# Altium schematic sheet NanoPiAir_SDR_Shield_V1.SchDoc
size A3; SheetNumber: 5; SheetTotal: 6; SPICEModelCacheYCATXEQH: <root> / <DocumentId>YCATXEQH</DocumentId> / </root>
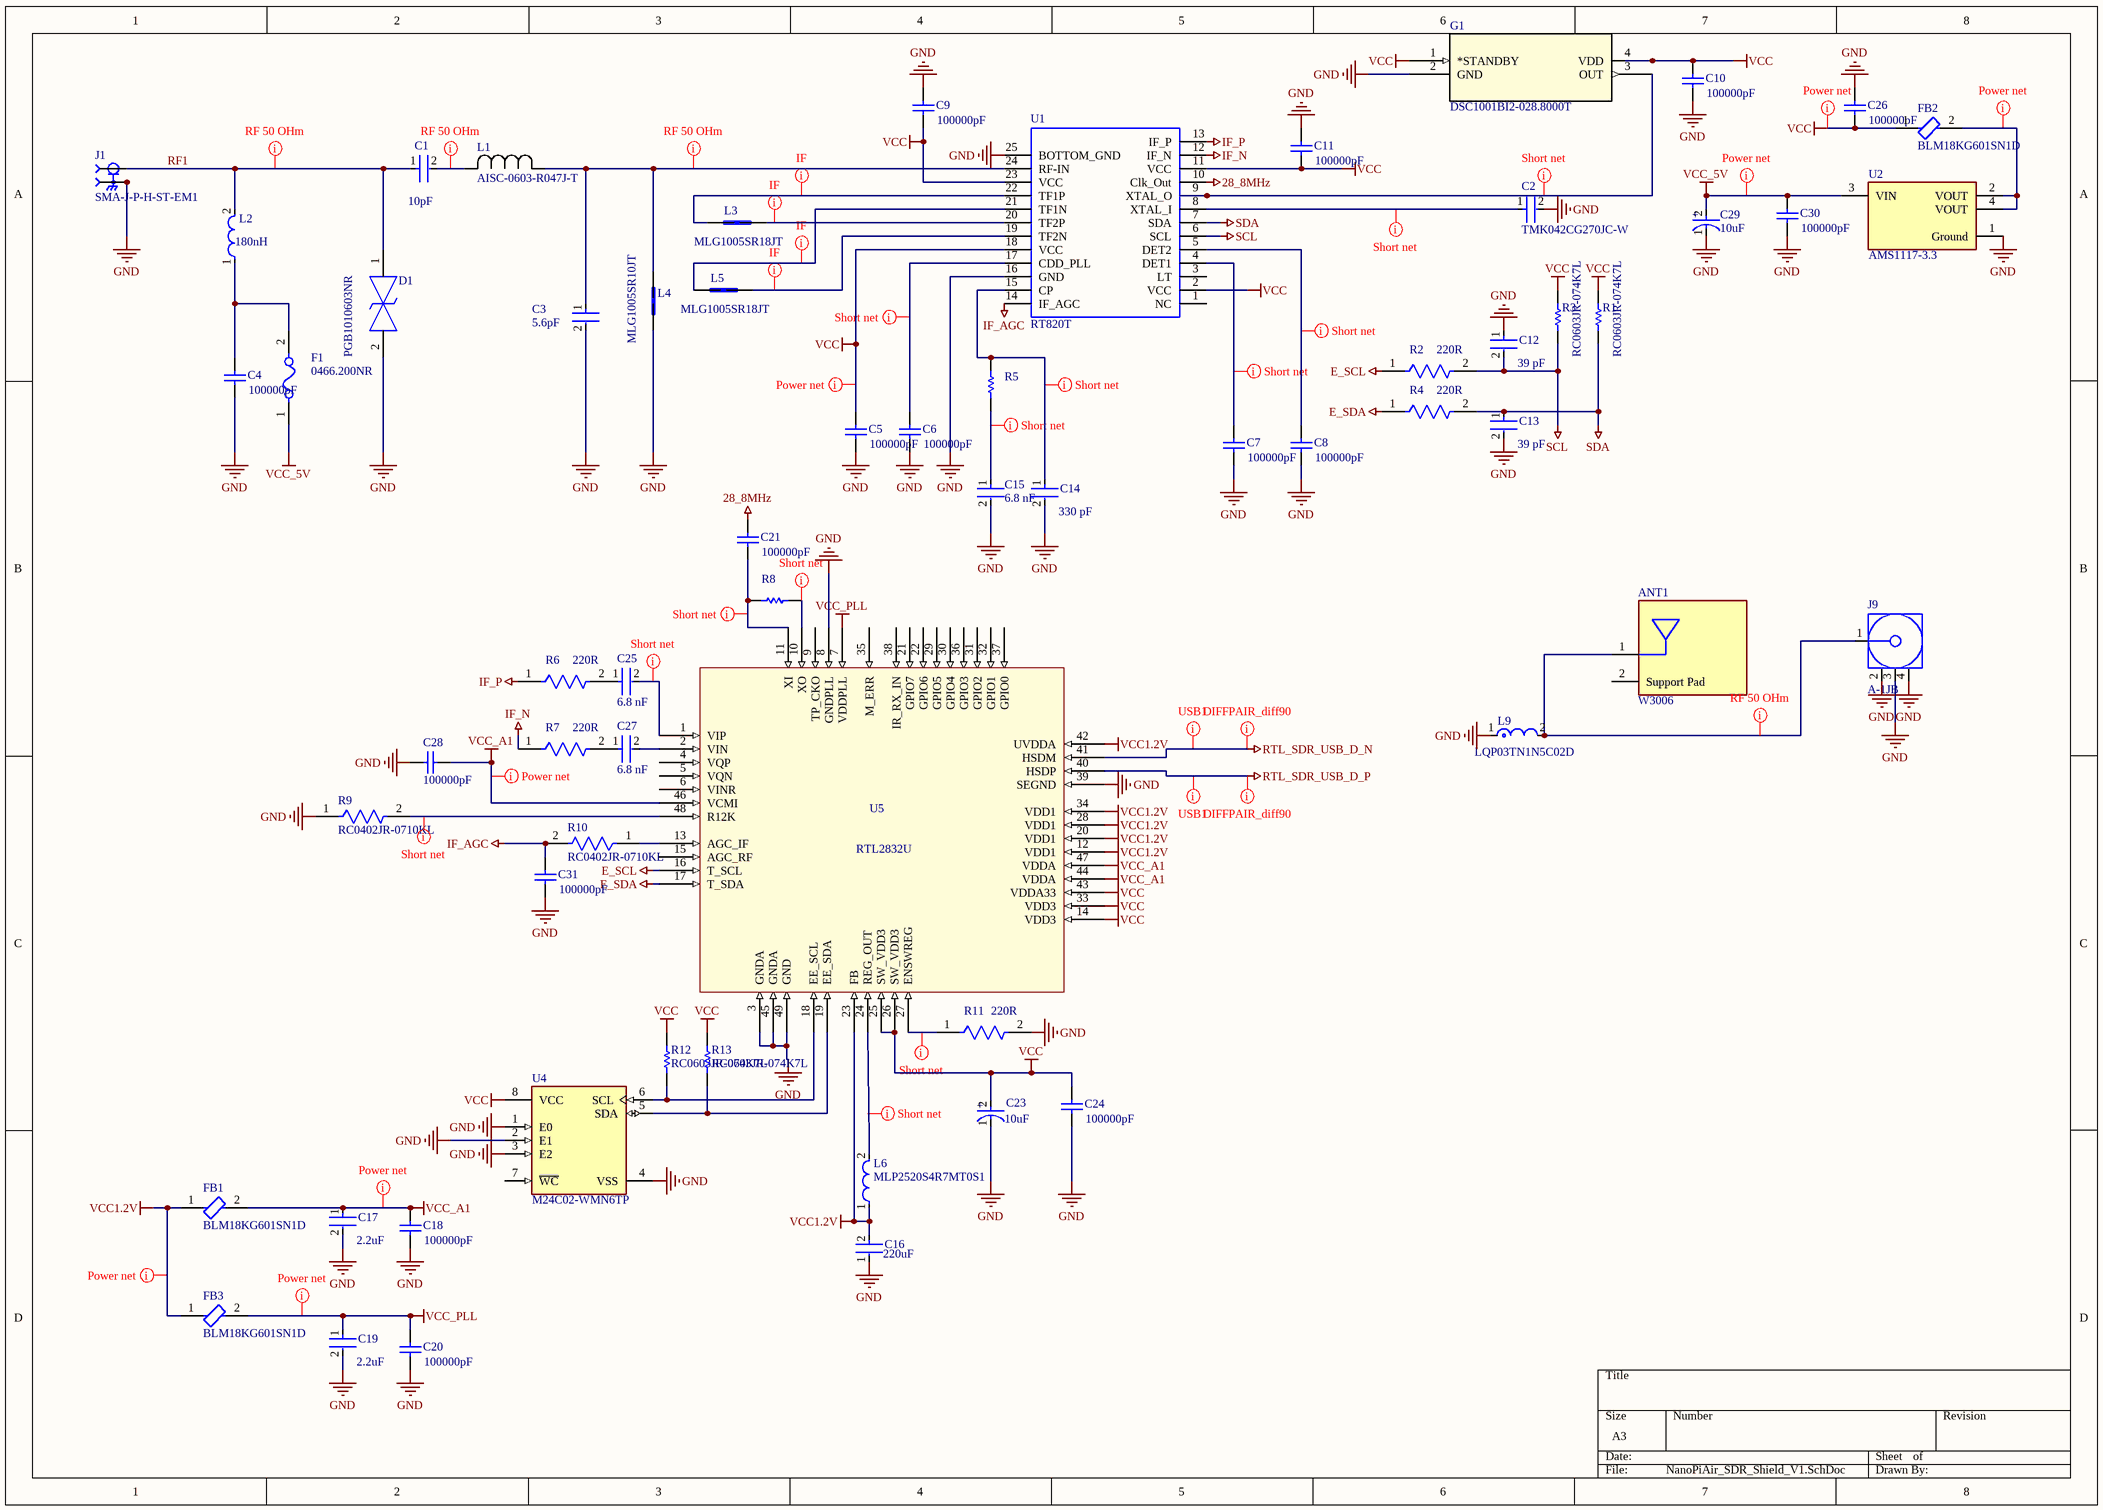
[diagram p0: NanoPiAir_SDR_Shield_V1.SchDoc]

## Parts
ANT1  W3006  [FP-W3006-0]
C1  Capacitance: 10pF  [FP-GJM155-0_05-IPC_B]  (hidden comment: GJM1555C1H100GB01D)
C2  TMK042CG270JC-W  [FP-01005-L_0_4_0_02-W_0_2-MFG]
C3  Capacitance: 5.6pF  [FP-GJM155-0_05-IPC_B]  (hidden comment: GJM1555C1H5R6CB01D)
C4  Capacitance: 100000pF  [CAPC1050X55X23ML05T13]  (hidden comment: CL05B104KO5NNNC)
C5  Capacitance: 100000pF  [CAPC1050X55X23ML05T13]  (hidden comment: CL05B104KO5NNNC)
C6  Capacitance: 100000pF  [CAPC1050X55X23ML05T13]  (hidden comment: CL05B104KO5NNNC)
C7  Capacitance: 100000pF  [CAPC1050X55X23ML05T13]  (hidden comment: CL05B104KO5NNNC)
C8  Capacitance: 100000pF  [CAPC1050X55X23ML05T13]  (hidden comment: CL05B104KO5NNNC)
C9  Capacitance: 100000pF  [CAPC1050X55X23ML05T13]  (hidden comment: CL05B104KO5NNNC)
C10  Capacitance: 100000pF  [CAPC1050X55X23ML05T13]  (hidden comment: CL05B104KO5NNNC)
C11  Capacitance: 100000pF  [CAPC1050X55X23ML05T13]  (hidden comment: CL05B104KO5NNNC)
C12  Capacitance: 39 pF  [FP-AC0402-0_5-MFG]  (hidden comment: AC0402JRNPO9BN390)
C13  Capacitance: 39 pF  [FP-AC0402-0_5-MFG]  (hidden comment: AC0402JRNPO9BN390)
C14  Capacitance: 330 pF  [FP-CC0402-MFG]  (hidden comment: CC0402KRX7R7BB331)
C15  value 6.8 nF  [FP-CC0402-MFG]  (hidden comment: CC0402KRX7R9BB682)
C16  Capacitance: 220uF  [FP-GRM31C-0_3-e0_3_0_9-IPC_C]  (hidden comment: GRM31CR60J227ME11L)
C17  Capacitance: 2.2uF  [FP-GRM155-0_05-MFG]  (hidden comment: GRM155R61A225KE95D)
C18  Capacitance: 100000pF  [CAPC1050X55X23ML05T13]  (hidden comment: CL05B104KO5NNNC)
C19  Capacitance: 2.2uF  [FP-GRM155-0_05-MFG]  (hidden comment: GRM155R61A225KE95D)
C20  Capacitance: 100000pF  [CAPC1050X55X23ML05T13]  (hidden comment: CL05B104KO5NNNC)
C21  Capacitance: 100000pF  [CAPC1050X55X23ML05T13]  (hidden comment: CL05B104KO5NNNC)
C23  Capacitance: 10uF  [FP-TAJA-MFG]  (hidden comment: TAJA106K010RNJ)
C24  Capacitance: 100000pF  [CAPC1050X55X23ML05T13]  (hidden comment: CL05B104KO5NNNC)
C25  value 6.8 nF  [FP-CC0402-MFG]  (hidden comment: CC0402KRX7R9BB682)
C26  Capacitance: 100000pF  [CAPC1050X55X23ML05T13]  (hidden comment: CL05B104KO5NNNC)
C27  value 6.8 nF  [FP-CC0402-MFG]  (hidden comment: CC0402KRX7R9BB682)
C28  Capacitance: 100000pF  [CAPC1050X55X23ML05T13]  (hidden comment: CL05B104KO5NNNC)
C29  Capacitance: 10uF  [FP-TAJA-MFG]  (hidden comment: TAJA106K010RNJ)
C30  Capacitance: 100000pF  [CAPC1050X55X23ML05T13]  (hidden comment: CL05B104KO5NNNC)
C31  Capacitance: 100000pF  [CAPC1050X55X23ML05T13]  (hidden comment: CL05B104KO5NNNC)
D1  PGB1010603NR  [PGB1010603MR]
F1  0466.200NR  [FP-0466-MFG]
FB1  BLM18KG601SN1D  [FP-BLM18-0_15-t0_8-IPC_A]
FB2  BLM18KG601SN1D  [FP-BLM18-0_15-t0_8-IPC_A]
FB3  BLM18KG601SN1D  [FP-BLM18-0_15-t0_8-IPC_A]
G1  DSC1001BI2-028.8000T  [CDFN4_5X3P2_MCH]
J1  SMA-J-P-H-ST-EM1  [SAMTEC_SMA-J-P-H-ST-EM1]
J9  A-1JB  [AMPH-A-1JB_V]
L1  AISC-0603-R047J-T  [AISC-0603_ABR]
L2  Inductance: 180nH  [FP-LQM18NN_00-IPC_C]  (hidden comment: LQM18NNR18K00D)
L3  MLG1005SR18JT  [CAPC1005X55N]
L4  MLG1005SR10JT  [CAPC1005X55N]
L5  MLG1005SR18JT  [CAPC1005X55N]
L6  MLP2520S4R7MT0S1  [FP-MLP2520M-IPC_C]
L9  LQP03TN1N5C02D  [FP-LQP03TG_02-IPC_A]
R1  RC0603JR-074K7L  [RESC1608X55X25ML10T15]
R2  Resistance: 220R  [FP-AC0402-IPC_C]  (hidden comment: AC0402FR-07220RL)
R3  RC0603JR-074K7L  [RESC1608X55X25ML10T15]
R4  Resistance: 220R  [FP-AC0402-IPC_C]  (hidden comment: AC0402FR-07220RL)
R5  RK73H1ETTP1801F  [RESC1005X40X25ML10T10]  (value not drawn)
R6  Resistance: 220R  [FP-AC0402-IPC_C]  (hidden comment: AC0402FR-07220RL)
R7  Resistance: 220R  [FP-AC0402-IPC_C]  (hidden comment: AC0402FR-07220RL)
R8  RC0402JR-07150KL  [RESC1005X40X25ML05T10]  (value not drawn)
R9  RC0402JR-0710KL  [FP-RC0402-0_4-IPC_C]
R10  RC0402JR-0710KL  [FP-RC0402-0_4-IPC_C]
R11  Resistance: 220R  [FP-AC0402-IPC_C]  (hidden comment: AC0402FR-07220RL)
R12  RC0603JR-074K7L  [RESC1608X55X25ML10T15]
R13  RC0603JR-074K7L  [RESC1608X55X25ML10T15]
U1  RT820T  [QFN24_4X4_SIL-L]
U2  AMS1117-3.3  [FP-AMS1117-IPC_C]
U4  M24C02-WMN6TP  [FP-SO8N-SO-A-MFG]
U5  RTL2832U  [QFN40P600X600X84_HS-49N]

## Nets
28_8MHz: C21.2 U1.10(Clk_Out)
E_SCL: R2.1 U5.16(T_SCL)
E_SDA: R4.1 U5.17(T_SDA)
GND: C2.2 C3.2 C4.1 C5.1 C6.1 C7.1 C8.1 C9.2 C10.1 C11.2 C12.1 C13.2 C14.2 C15.2 C16.1 C17.2 C18.1 C19.2 C20.1 C23.1(C) C24.1 C26.2 C28.2 C29.1(C) C30.1 C31.1 D1.2 G1.2(GND) J1.2_1 J1.2_2 J1.3_1 J1.3_2 J9.2 J9.3 J9.4 L4.1 L9.1 R9.1 R11.2 U1.16(GND) U1.25(BOTTOM_GND) U2.1(Ground) U4.1(E0) U4.2(E1) U4.3(E2) U4.4(VSS) U5.3(GNDA) U5.8(GNDPLL) U5.39(SEGND) U5.45(GNDA) U5.49(GND)
IF_AGC: C31.2 R10.2 U1.14(IF_AGC)
IF_N: R7.1 U1.12(IF_N)
IF_P: R6.1 U1.13(IF_P)
RTL_SDR_USB_D_N: U5.41(HSDM)
RTL_SDR_USB_D_P: U5.40(HSDP)
SCL: C12.2 R2.2 R3.2 U1.6(SCL)
SDA: C13.1 R1.2 R4.2 U1.7(SDA)
VCC: C5.2 C9.1 C10.2 C11.1 C23.2(A) C24.2 C26.1 FB2.1 G1.1(*STANDBY) G1.4(VDD) R1.1 R3.1 R12.1 R13.1 U1.2(VCC) U1.11(VCC) U1.18(VCC) U1.23(VCC) U4.8(VCC) U5.14(VDD3) U5.25(SW_VDD3) U5.26(SW_VDD3) U5.33(VDD3) U5.43(VDDA33)
VCC1.2V: C16.2 FB1.1 FB3.1 L6.1 U5.12(VDD1) U5.20(VDD1) U5.23(FB) U5.28(VDD1) U5.34(VDD1) U5.42(UVDDA)
VCC_5V: C29.2(A) C30.2 F1.1 U2.3(VIN)
VCC_A1: C17.1 C18.2 C28.1 FB1.2 U5.44(VDDA) U5.46(VCMI) U5.47(VDDA)
VCC_PLL: C19.1 C20.2 FB3.2 U5.7(VDDPLL)
RF1: C1.1 D1.1 J1.1 L2.2
NetANT1_1: ANT1.1(Feed) J9.1 L9.2
NetC1_2: C1.2 L1.2
NetC2_1: C2.1 U1.8(XTAL_I)
NetC3_1: C3.1 L1.1 L4.2 U1.24(RF-IN)
NetC4_2: C4.2 F1.2 L2.1
NetC6_2: C6.2 U1.17(CDD_PLL)
NetC7_2: C7.2 U1.4(DET1)
NetC8_2: C8.2 U1.5(DET2)
NetC14_1: C14.1 R5.2 U1.15(CP)
NetC15_1: C15.1 R5.1
NetC21_1: C21.1 R8.2 U5.11(XI)
NetC25_1: C25.1 R6.2
NetC25_2: C25.2 U5.1(VIP)
NetC27_1: C27.1 R7.2
NetC27_2: C27.2 U5.2(VIN)
NetFB2_2: FB2.2 U2.2(VOUT) U2.4(VOUT)
NetG1_3: G1.3(OUT) U1.9(XTAL_O)
NetL3_1: L3.1 U1.22(TF1P)
NetL3_2: L3.2 U1.20(TF2P)
NetL5_1: L5.1 U1.21(TF1N)
NetL5_2: L5.2 U1.19(TF2N)
NetL6_2: L6.2 U5.24(REG_OUT)
NetR8_1: R8.1 U5.10(XO)
NetR9_2: R9.2 U5.48(R12K)
NetR10_1: R10.1 U5.13(AGC_IF)
NetR11_1: R11.1 U5.27(ENSWREG)
NetR12_2: R12.2 U4.6(SCL) U5.18(EE_SCL)
NetR13_2: R13.2 U4.5(SDA) U5.19(EE_SDA)

Not connected (* = marked no-connect by the designer): ANT1 2(Support_Pad); U1 1(NC) 3(LT); U4 7(~{WC}); U5 4(VQP) 5(VQN) 6(VINR) 9(TP_CKO) 15(AGC_RF) 21(GPIO7) 22(GPIO6) 29(GPIO5) 30(GPIO4) 31(GPIO2) 32(GPIO1) 35(M_ERR) 36(GPIO3) 37(GPIO0) 38(IR_RX_IN)

## Layout directives
net class RF_50: NetANT1_1, NetC1_2, NetC3_1, RF1
net class IF_COILS: NetL3_1, NetL3_2, NetL5_1, NetL5_2
net class Power: NetFB2_2, VCC, VCC1.2V, VCC_5V, VCC_A1, VCC_PLL
net class SHORT_NET: (no net found under the mark), NetC2_1, NetC6_2, NetC7_2, NetC8_2, NetC14_1, NetC15_1, NetC21_1, NetC25_2, NetG1_3, NetR8_1, NetR9_2, NetR11_1
differential pair; differential pair class diff90: RTL_SDR_USB_D_N, RTL_SDR_USB_D_P
net class USB1: RTL_SDR_USB_D_N, RTL_SDR_USB_D_P

## Notes on the sheet
- (in symbol CMP-2000-07217-2) +

## Library data of the parts
ANT1 = CMP-16379-000003-1: RF ANT 2.4GHZ/5.5GHZ CHIP SLD; Frequency: 5GHz; Max Frequency: 5.85GHz; Min Frequency: 2.4GHz; Return Loss: -10dB; Number of Bands: 2; Impedance: 50R; Radiation Hardening: No; Mount: Surface Mount; Contact Plating: Tin; Width: 3.2mm; Series: -; Packaging: Bulk; RoHS Compliant: Yes; Package Quantity: 1; Min Operating Temperature: -40°C; Number of Pins: 2; Length: 10mm; Termination: Solder; Height: 0.059inch; Max Operating Temperature: 85°C; Case/Package: SMD/SMT
C1 = CMP-2008-03796-2: Multi-Layer Ceramic Capacitor 10pF C0G  ±2% 0402 Paper T/R; Voltage Rating: 50V; Thickness: 0.022inch; Case Code (Imperial): 0402; Height: 0.5mm; Min Operating Temperature: -55°C; Lead Free: Lead Free; Case Code (Metric): 1005; Mount: Surface Mount; Voltage Rating (DC): 50V; Width: 0.5mm; Max Operating Temperature: 125°C; Case/Package: 0402; Packaging: Tape and Reel; Depth: 0.5mm; Package Quantity: 1; Termination: SMD/SMT; Length: 1mm; Dielectric: C0G; Tolerance: 2%; Radiation Hardening: No
C2 = CMP-14477-000467-2: None; RoHS Compliant: Yes
C3 = CMP-2008-03866-2: Multi-Layer Ceramic Capacitor 5.6pF C0G  ±0.25pF 0402 Paper T/R; Voltage Rating: 50V; Lead Free: Lead Free; Radiation Hardening: No; Termination: SMD/SMT; Width: 0.02inch; Thickness: 0.022inch; Depth: 0.5mm; Max Operating Temperature: 125°C; Package Quantity: 1; Case Code (Imperial): 0402; Case Code (Metric): 1005; Mount: Surface Mount; Voltage: 50V; Packaging: Tape and Reel; Length: 1mm; Voltage Rating (DC): 50V; Case/Package: 0402; Dielectric: C0G; Min Operating Temperature: -55°C; Height: 0.5mm
C4-C11 C18 C20 C21 C24 C26 C28 C30 C31 = CMP-2000-05439-1: Chip Capacitor, 100 nF, +/- 10%, 16 V, -55 to 125 degC, 0402 (1005 Metric), RoHS, Tape and Reel; Manufacturer: Samsung Electro-Mechanics; Dielectric: X7R; Rated Voltage: 16V; Case Size/Dimension: 0402; Tolerance (%): ±10%; Manufacturer URL: http://www.samsungsem.com/global/index.jsp; Datasheet URL: https://datasheet.ciiva.com/29198/458718-da-01-en-vs-kondensator-0402-29198423.pdf; Datasheet Version: Nov-10
C12 C13 = CMP-03422-000238-1: AC0402 39 pF NPO 5.00% 50 V; Manufacturer: Yageo; Material: Ceramic; Voltage Rating: 50 V; Temperature Coefficient: 30ppm/°C; Automotive Grade: Grade 1; Tolerance: 0.05; Value: 39 pF; Temperature: -55°C to +125°C; Height: 0.55mm; Category: Cap; ComponentLink2URL: http://www.yageo.com/documents/recent/UPY-AC_NP0X7R_16V-to-630V_12.pdf; Device Class L1: Passive Components; Temperature Range Low: -55°C; Device Class L3: Ceramic Capacitors; ComponentLink2Description: Datasheet; Manufacturer Part Number: AC0402JRNPO9BN390; Ipc Land Pattern Name: CAPC10050X50; RoHS: TRUE; Automotive: Yes; Package: AC0402-0.5; Lead Free: Yes; Footprint Url: http://www.yageo.com/exep/pages/download/literatures/UPY-C_GEN_24.pdf; Octopart: https://octopart.com/ac0402jrnpo9bn390-yageo-77081752; Temperature Range High: +125°C; Temperature Characteristic: NPO; Device Class L2: Capacitors
C14 = CMP-03422-001298-1: CC0402 330 pF X7R 10.00% 16 V; Manufacturer: YAGEO; Material: Ceramic; Automotive Grade: NA; Temperature Coefficient: 30ppm/°C; Voltage Rating: 16 V; Tolerance: 0.1; Value: 330 pF; Ipc Land Pattern Name: CAPC10050X50; Device Class L2: Capacitors; ComponentLink2Description: Datasheet; Mouser Description: Surface Mount Ceramic Multilayer Capacitor 330pF 10% X7R 16V 0402 Paper T/R; Temperature Characteristic: X7R; Package: CC0402; Footprint Url: http://www.yageo.com/exep/pages/download/literatures/UPY-C_GEN_24.pdf; Device Class L1: Passive Components; Height: 0.55mm; Device Class L3: Ceramic Capacitors; Automotive: No; Lead Free: Yes; Octopart: https://octopart.com/cc0402krx7r7bb331-yageo-87194285; Temperature Range Low: -55°C; Temperature: -55°C to +125°C; RoHS: TRUE; ComponentLink2URL: http://www.yageo.com/documents/recent/UPY-GP_NP0_16V-to-50V_16.pdf; Category: Cap; Manufacturer Part Number: CC0402KRX7R7BB331; Temperature Range High: +125°C
C15 C25 C27 = CMP-03422-000952-1: CAP CER 6800PF 50V X7R 0402; Manufacturer: YAGEO; Tolerance: 0.1; Material: Ceramic; Temperature Coefficient: 30ppm/°C; Automotive Grade: NA; Device Class L3: Ceramic Capacitors; Automotive: No; Capacitance: 6.8 nF; Footprint Url: http://www.yageo.com/exep/pages/download/literatures/UPY-C_GEN_24.pdf; Digikey Description: CAP CER 6800PF 50V X7R 0402; Octopart: https://octopart.com/cc0402krx7r9bb682-yageo-9291871; Height: 0.55mm; Manufacturer Part Number: CC0402KRX7R9BB682; Temperature Characteristic: X7R; Lead Free: Yes; Mouser Description: 0402 6.8 nF 50 V ±10 % Tolerance X7R SMT Multilayer Ceramic Capacitor; ComponentLink2URL: http://www.yageo.com/documents/recent/UPY-GP_NP0_16V-to-50V_16.pdf; Device Class L1: Passive Components; Category: Cap; Ipc Land Pattern Name: CAPC10050X50; Temperature Range Low: -55°C; Package: CC0402; Temperature: -55°C to +125°C; Device Class L2: Capacitors; Voltage Rating: 50 V; ComponentLink2Description: Datasheet; RoHS: TRUE; Temperature Range High: +125°C
C16 = CMP-06035-000079-2: Chip Multilayer Ceramic Capacitors for General Purpose, 1206, 220uF, X5R, 15%, 20%, 6.3V; Mount: Surface Mount; Width: 0.063inch; Voltage Rating: 6.3V; Packaging: Cut Tape; Dielectric: X5R; Voltage Rating (DC): 6.3V; Case/Package: 1206; Thickness: 0.075inch; Tolerance: 20%; Max Operating Temperature: 85°C; Case Code (Metric): 3216; Min Operating Temperature: -55°C; Length: 0.126inch; REACH SVHC: No SVHC; Case Code (Imperial): 1206
C17 C19 = CMP-06035-063009-1: CAP CER 2.2UF 10V X5R 0402; Material: Ceramic; Tolerance: 10%; Max Operating Temperature: 85°C; Min Operating Temperature: -55°C; Weight: 0.000212oz; Lead Free: Lead Free; Case Code (Imperial): 0402; Case Code (Metric): 1005; Length: 1mm; Packaging: Tape and Reel; Depth: 0.5mm; Voltage Rating: 10V; REACH SVHC: No SVHC; Width: 0.5mm; Case/Package: 0402; RoHS Compliant: Yes; Termination: SMD/SMT; Voltage Rating (DC): 10V; Height: 0.5mm; Mount: Surface Mount; Package Quantity: 10000; Dielectric: X5R; Thickness: 0.022inch
C23 C29 = CMP-2000-07217-2: 10uF 10V  ±10% 3Ω 1206  SMD Tantalum Capacitor; ESR (Equivalent Series Resistance): 3R; Dissipation Factor: 6%; Leakage Current: 1uA; Polarity: Polar; Q Factor: 6; Case Code (Imperial): 1206; RoHS Compliant: Yes; Case Code (Metric): 3216; Voltage Rating (DC): 10V; REACH SVHC: No SVHC; Mount: Surface Mount; Package Quantity: 1; Radiation Hardening: No; Width: 1.6mm; Depth: 1.6mm; Packaging: Tape and Reel; Termination: SMD/SMT; Length: 3.2mm; Tolerance: 10%; Features: General Purpose; Case/Package: 1206; Max Operating Temperature: 125°C; Voltage Rating: 10V; Height - Seated (Max): 0.071inch; Series: TAJ; Height: 1.6mm; Min Operating Temperature: -55°C; Voltage: 10V; Number of Pins: 2; Construction: Flat; Dielectric Material: Tantalum; Lead Free: Lead Free
D1 = PGB1010603NR: ESD Suppressors / TVS Diodes 0603 24VDC .06pF; Manufacturer_Name: LITTELFUSE; Geometry.Height: 0.36mm; Mouser Part Number: 576-PGB1010603NR; Mouser Price/Stock: https://www.mouser.co.uk/ProductDetail/Littelfuse/PGB1010603NR?qs=gu7KAQ731UTJOoBJUwB8FA%3D%3D; Manufacturer_Part_Number: PGB1010603NR; Datasheet Link: https://www.littelfuse.com/data/en/data_sheets/littelfuse_pulseguard-esd_pgb1.pdf
F1 = CMP-08605-000081-1: FUSE BOARD MNT 200MA 125VAC/VDC; Body Material: Thermoplastic; Voltage Rating: 125V; Fuse Type: Board Mount (Cartridge Style Excluded); Resistance: 1.15R; Approvals: UL; DC Cold Resistance: 1.16R; Case Code (Metric): 3216; Depth: 1.52mm; Case/Package: 1206; Lead Free: Lead Free; Length: 3.18mm; Max Operating Temperature: 90°C; Case Code (Imperial): 1206; Terminal Material: Copper; Radiation Hardening: No; Working Voltage: 125V; Packaging: Tape and Reel; Width: 0.06inch; Housing Material: Ceramic; Voltage Rating (AC): 125V; Current Rating: 200mA; Fuse Current: 200mA; Package Quantity: 5000; Height: 0.023inch; Termination: SMD/SMT; Voltage Rating (DC): 125V; Mount: Surface Mount; Min Operating Temperature: -55°C; Number of Pins: 2
FB1-FB3 = CMP-0686-00581-3: Chip Ferrite Bead, 0603, 600Ω @ 100MHz, 0.15Ω, 25%, 1.3A; Material: Steel; Number of Lines: 1; Impedance: 600R; DC Resistance (DCR): 150mR; Tolerance: 25%; Case Code (Metric): 1608; Width: 0.8mm; DC Current: 1.3A; Max DC Current: 1.3A; Package Quantity: 1; Number of Pins: 2; Military Standard: Not; RoHS Compliant: Yes; Termination: SMD/SMT; Max Operating Temperature: 125°C; Length: 1.6mm; Depth: 0.8mm; Case Code (Imperial): 0603; Series: BLM18K; Inductor Type: FERRITE BEAD; Core Material: Ferrite; Number of Circuits: 1; Height: 0.8mm; Case/Package: 0603; REACH SVHC: No SVHC; Packaging: Tape and Reel; Min Operating Temperature: -55°C; Max Current Rating: 1.3A; Radiation Hardening: No; Current Rating: 1.3A; Lead Free: Lead Free; Test Frequency: 100MHz; Weight: 7.1E-05oz
G1 = DSC1001BI2-028.8000T: No Description Available; Mfr_Name: Microchip; Copyright: Copyright (C) 2023 Ultra Librarian. All rights reserved.; Manufacturer_Part_Number: DSC1001BI2-028.8000T; Digi-Key_Part_Number_1: DSC1001BI2-028.8000T-ND; RefDes: RefDes; Type: DEV
J1 = SMA-J-P-H-ST-EM1: SMA Connector Jack, Female Socket 50Ohm Board Edge, End Launch Solder; Price: None; MP: SMA-J-P-H-ST-EM1; Value: *; Availability: Unavailable; Package: None
J9 = CMP-1743-00001-1: AMC PCB Jack, 0 to 60 GHz, 60 V, -40 to 90 degC, 4-Pin SMD, RoHS, Tape and Reel; Capacitance: 100 uF; Case\Package: 2917; Voltage Rating (DC): 10 V; ESR: 700 mohm; Tolerance: 10%; ComponentLink1Description: Datasheet; PackageDescription: 4-Pin Surface Mount Device, Body 2.6 x 2.6 mm; Radiation Hardening: No; Package Quantity: 1; REACH SVHC: No SVHC; DatasheetVersion: Rev. K, 05/2016; ComponentLink1URL: http://drawings.amphenolrf.com/Customer_Outline/CA-1JB.pdf; Pins: 2; Packaging: Tape and Reel; Min Operating Temperature: -55 degC; RoHSCompliant: true; Length: 7.3 mm; PackageReference: A-1JB; Weight: 0.023634 oz; Mount: Surface Mount; Voltage Rating: 10 V; Max Operating Temperature: 125 degC; Height: 3.1 mm; Case Code (Imperial): 2917; Case Code (Metric): 7343; Width: 4.3 mm
L1 = AISC-0603-R047J-T: No Description Available; Mfr_Name: Abracon; Type: DEV; Copyright: Copyright (C) 2023 Ultra Librarian. All rights reserved.; Manufacturer_Part_Number: AISC-0603-R047J-T; Digi-Key_Part_Number_1: 535-10471-1-ND; Digi-Key_Part_Number_2: 535-10471-2-ND; Digi-Key_Part_Number_3: 535-10471-6-ND; RefDes: RefDes
L2 = CMP-06042-016946-1: Multilayer Type Inductor for General Circuits, 0603 (1608), 180nH, 10%, 0.6Ω, 50mA; Shielding: Shielded; Q Factor: 15; Self Resonant Frequency: 165MHz; Test Frequency: 25MHz; Core Material: Ferrite; DC Resistance (DCR): 600mR; Inductor Type: MONOLITHIC; Packaging: Tape and Reel; Case Code (Metric): 1608; Inductance Tolerance: 10%; Max Operating Temperature: 85°C; Height: 0.8mm; Min Operating Temperature: -40°C; Current Rating: 50mA; Max DC Current: 50mA; Mount: Surface Mount; Length: 1.6mm; Military Standard: Not; REACH SVHC: No SVHC; Series: LQM18N; Number of Pins: 2; Width: 0.031inch; Tolerance: 10%; DC Current: 50mA; Package Quantity: 4000; Depth: 0.95mm; Case/Package: 0603; Case Code (Imperial): 0603; Height - Seated (Max): 0.035inch; RoHS Compliant: Yes; Termination: SMD/SMT
L3-L5 = MLG1005SR18JT: Ind High Frequency Chip Unshielded Multi-Layer 180nH 5% 100MHz 8Q-Factor Ceramic 150mA 0402 T/R; Package: None; Price: None; Value: *; MP: MLG1005SR18JT; Availability: Unavailable
L6 = CMP-08253-000319-1: Shielded Multilayer Inductor 4.7uH ±20% 1000mA 169mΩ SMD 1008; Test Frequency: 2MHz; DC Resistance (DCR): 169mR; Core Material: Ferrite; Current Rating: 1A; Max Operating Temperature: 125°C; Packaging: Tape and Reel; Length: 0.098inch; Shielding: Shielded; Height - Seated (Max): 0.039inch; Case Code (Imperial): 1008; Tolerance: 20%; Width: 0.079inch; Package Quantity: 3000; Case/Package: 1008; Case Code (Metric): 2520; RoHS Compliant: Yes; Mount: Surface Mount; Inductance: 4.7uH; Min Operating Temperature: -40°C
L9 = CMP-06042-004740-1: Film type RF Inductor 1.5nH ±0.2nH 600mA 0.15Ω 0201 (0603); DC Resistance (DCR): 150mR; Test Frequency: 500MHz; Shielding: Unshielded; Core Material: Non-Magnetic; Q Factor: 14; Self Resonant Frequency: 15GHz; Current Rating: 600mA; Packaging: Tape and Reel; Weight: 6E-06oz; Termination: SMD/SMT; Case Code (Imperial): 0201; Max DC Current: 600mA; Case Code (Metric): 0603; Case/Package: 0201; Width: 0.012inch; Radiation Hardening: No; DC Current: 600mA; Package Quantity: 15000; Length: 0.024inch; Depth: 0.33mm; Max Operating Temperature: 125°C; Min Operating Temperature: -55°C; Inductance: 1.5nH; Height: 0.3mm; Height - Seated (Max): 0.013inch; Lead Free: Lead Free; Military Standard: Not; Resistor Type: Thin Film; Mount: Surface Mount
R1 R3 R12 R13 = CMP-2000-05024-1: Chip Resistor, 4.7 KOhm, +/- 5%, 100 mW, -55 to 155 degC, 0603 (1608 Metric), RoHS, Tape and Reel; Manufacturer: Yageo; Resistance: 4.7kOhms; Temperature Coefficient: 100PPM/C; Power Rating: 100mW; Voltage Rating: 50V; Operating Temperature Range: -55Cto+155C; Case Code - mm: 1608; Tolerance: 5%; Product: ThickFilmResistorsGeneralPurpose; Case Code - in: 0603; Datasheet URL: http://www.yageo.com/documents/recent/PYu-RC_Group_51_RoHS_L_04.pdf; Package Reference: 603; Datasheet Version: Rev. 4, 02/2016; Package Description: 2-Pin Surface Mount Device, Body 1.6 x 0.8 mm; Manufacturer URL: http://www.yageo.com/; Series: RC; Packaging: Reel; Termination Style: SMD/SMT
R2 R4 R6 R7 R11 = CMP-03412-022228-2: RES 220Ω ±1% 0.063W 0402; Voltage Rating: 50V; Power Rating: 62.5mW; Temperature Coefficient: 100ppm/°C; Max Power Dissipation: 63mW; Resistor Type: Thick Film; Case/Package: 0402; Case Code (Imperial): 0402; Max Operating Temperature: 155°C; Military Standard: Not; Construction: Rectangular; Packaging: Tape and Reel; Series: AC; Lead Free: Lead Free; Length: 0.039inch; Termination: SMD/SMT; Case Code (Metric): 1005; RoHS Compliant: Yes; Width: 0.5mm; Min Operating Temperature: -55°C; Tolerance: 1%; Height: 0.015inch; Depth: 0.5mm; Weight: 2.3E-05oz; Number of Terminations: 2; Features: Moisture Resistant
R5 = CMP-2002-03883-1: Manufacturer: KOA Speer; Part Number: RK73H1ETTP1801F
R8 = CMP-1011-00126-2: Manufacturer: Yageo / Phycomp; Part Number: RC0402JR-07150KL
R9 R10 = CMP-2002-07915-3: RES 10K OHM 5% 1/16W 0402; Max Power Dissipation: 63mW; Temperature Coefficient: 100ppm/°C; Power Rating: 62.5mW; Resistance: 10kR; Voltage Rating: 50V; Size Code: 0402; Resistance Tolerance: 5%; Packaging: Tape and Reel; Case Code (Metric): 1005; Lead Free: Lead Free; Resistor Type: Thick Film; Min Operating Temperature: -55°C; Military Standard: Not; Depth: 0.5mm; Series: RC; Case/Package: 0402; Construction: Rectangular; Number of Terminations: 2; Package Quantity: 1; Termination: SMD/SMT; Length: 0.039inch; Case Code (Imperial): 0402; Height: 0.016inch; Features: Moisture Resistant; RoHS Compliant: Yes; Max Operating Temperature: 155°C; Tolerance: 5%; Width: 0.02inch
U1 = RT820T-QFN24: High Performance Low Power / Advanced Digital TV Silicon Tuner; Manufacturer_Name: Rafael Technology; Geometry.Height: 0.9mm; Manufacturer_Part_Number: RT820T; Datasheet Link: https://www.rtl-sdr.com/wp-content/uploads/2013/04/R820T_datasheet-Non_R-20111130_unlocked1.pdf
U2 = CMP-209535-000001-1: LDO Voltage Regulators 1A, 3.3V; Manufacturer: Advanced Monolithic Systems; Dropout Voltage: 1.1V; Output Type: Fixed; Nominal Supply Current: 5mA; Max Power Dissipation: 1.2W; Max Supply Voltage: 15V; Number Of Outputs: 1; Standoff Height: 0.64mm; Max Junction Temp: +125°C; Height: 1.8mm; Package: AMS1117; Device Class L2: Power Management ICs; ComponentLink2Description: Datasheet; ComponentLink2URL: http://www.advanced-monolithic.com/pdf/ds1117.pdf; Category: IC; RoHS: TRUE; Automotive: No; Device Class L1: Integrated Circuits (ICs); Output Current: 1A; Device Class L3: Voltage Regulators - Linear; Temperature: -40°C to +125°C; Output Voltage: 3.3V; Manufacturer Part Number: AMS1117-3.3; Temperature Range Low: -40°C; Octopart: https://octopart.com/ams1117-3.3-advanced+monolithic+systems-25899300; Lead Free: Yes; Ipc Land Pattern Name: SOT229P700X180-4; Temperature Range High: +125°C
U4 = CMP-2000-05370-2: IC EEPROM 2K I2C 400KHZ 8SO; Manufacturer: STMicroelectronics; Min Supply Voltage: 2.5V; Standoff Height: 0.1mm; Nominal Supply Current: 0.5-1mA; Access Time: 900ns; Memory Size: 2Kbits; Max Supply Voltage: 5.5V; Digikey Description: IC EEPROM 2K I2C 400KHZ 8SO; Memory Type: EEPROM; ComponentLink2URL: https://www.st.com/resource/en/datasheet/m24c02-w.pdf; Device Class L3: EEPROM; Interface: I2C; Temperature Range High: +85°C; Mouser Description: M24C02 Series 2 Kb (256 x 8) 2.5 V SMT Serial I²C Bus EEPROM - SOIC-8; RoHS: TRUE; Lead Free: Yes; Ambient Temperature Range Low: -40°C; Temperature: -40°C to +85°C; Device Class L1: Integrated Circuits (ICs); Temperature Range Low: -40°C; Frequency: 400kHz; Category: IC; Manufacturer Part Number: M24C02-WMN6TP; Height: 1.75mm; Octopart: https://octopart.com/m24c02-wmn6tp-stmicroelectronics-55404516; Automotive: No; Ambient Temperature Range High: +85°C; ComponentLink2Description: Datasheet; Package: SO8N-SO-A; Device Class L2: Memory
U5 = RTL2832U: RTL2832U DVB-T COFDM Demodulator + USB 2.0; Manufacturer: Realtek; Publisher: ftg; ComponentLink1Description: Work on RTL2832U Datasheet; ComponentLink1URL: https://sites.google.com/site/oh2ftg/home/rtl2832u; Mounting: Surface Mount; Package: QFN48